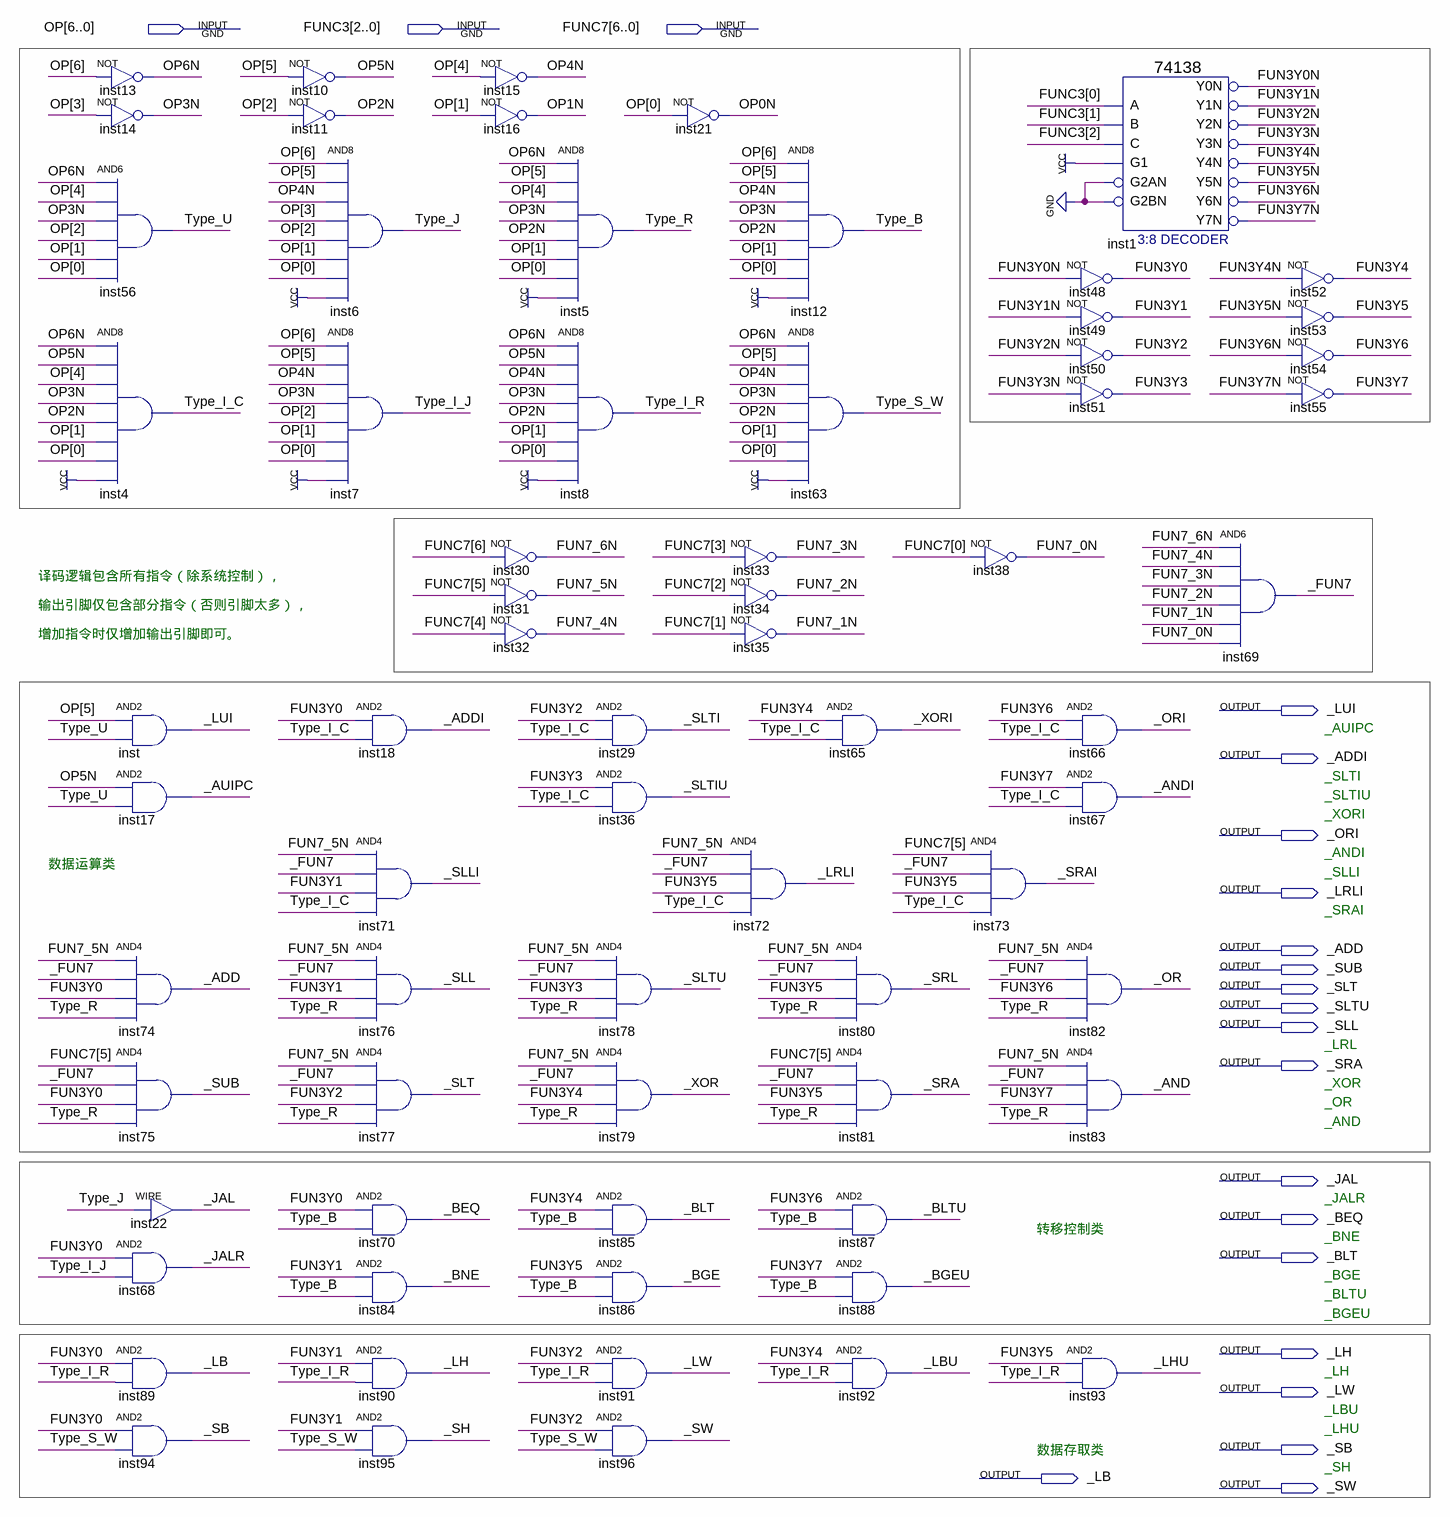
[diagram p0: schematic sheet]
// Quartus schematic ID.bdf as structural Verilog: 69 symbols, 21 pins
module ID (
  input  [6:0] OP,
  input  [2:0] FUNC3,
  input  [6:0] FUNC7,
  output _LUI,
  output _ADDI,
  output _ORI,
  output _LRLI,
  output _ADD,
  output _SUB,
  output _SLT,
  output _SLTU,
  output _SLL,
  output _SRA,
  output _JAL,
  output _BEQ,
  output _BLT,
  output _LH,
  output _LW,
  output _SB,
  output _LB,
  output _SW
);

  wire _AND, _ANDI, _AUIPC, _BGE, _BGEU, _BLTU, _BNE, _FUN7, _JALR, _LBU, _LHU, _OR, _SH, _SLLI, _SLTI,
       _SLTIU, _SRAI, _SRL, _XOR, _XORI, FUN3Y0, FUN3Y0N, FUN3Y1, FUN3Y1N, FUN3Y2, FUN3Y2N, FUN3Y3, FUN3Y3N,
       FUN3Y4, FUN3Y4N, FUN3Y5, FUN3Y5N, FUN3Y6, FUN3Y6N, FUN3Y7, FUN3Y7N, FUN7_0N, FUN7_1N, FUN7_2N,
       FUN7_3N, FUN7_4N, FUN7_5N, FUN7_6N, OP0N, OP1N, OP2N, OP3N, OP4N, OP5N, OP6N, Type_B, Type_I_C,
       Type_I_J, Type_I_R, Type_J, Type_R, Type_S_W, Type_U;

  not inst13 (OP6N, OP[6]);
  not inst14 (OP3N, OP[3]);
  and inst56 (Type_U, OP6N, OP[4], OP3N, OP[2], OP[1], OP[0]);
  and inst4 (Type_I_C, OP6N, OP5N, OP[4], OP3N, OP2N, OP[1], OP[0], 1'b1);
  and inst (_LUI, OP[5], Type_U);
  and inst17 (_AUIPC, OP5N, Type_U);
  and inst74 (_ADD, FUN7_5N, _FUN7, FUN3Y0, Type_R);
  and inst75 (_SUB, FUNC7[5], _FUN7, FUN3Y0, Type_R);
  assign _JAL = Type_J;  // WIRE inst22
  and inst68 (_JALR, FUN3Y0, Type_I_J);
  and inst89 (_LB, FUN3Y0, Type_I_R);
  and inst94 (_SB, FUN3Y0, Type_S_W);
  not inst10 (OP5N, OP[5]);
  not inst11 (OP2N, OP[2]);
  and inst6 (Type_J, OP[6], OP[5], OP4N, OP[3], OP[2], OP[1], OP[0], 1'b1);
  and inst7 (Type_I_J, OP[6], OP[5], OP4N, OP3N, OP[2], OP[1], OP[0], 1'b1);
  and inst18 (_ADDI, FUN3Y0, Type_I_C);
  and inst71 (_SLLI, FUN7_5N, _FUN7, FUN3Y1, Type_I_C);
  and inst76 (_SLL, FUN7_5N, _FUN7, FUN3Y1, Type_R);
  and inst77 (_SLT, FUN7_5N, _FUN7, FUN3Y2, Type_R);
  and inst70 (_BEQ, FUN3Y0, Type_B);
  and inst84 (_BNE, FUN3Y1, Type_B);
  and inst90 (_LH, FUN3Y1, Type_I_R);
  and inst95 (_SH, FUN3Y1, Type_S_W);
  not inst15 (OP4N, OP[4]);
  not inst16 (OP1N, OP[1]);
  not inst30 (FUN7_6N, FUNC7[6]);
  not inst31 (FUN7_5N, FUNC7[5]);
  not inst32 (FUN7_4N, FUNC7[4]);
  and inst5 (Type_R, OP6N, OP[5], OP[4], OP3N, OP2N, OP[1], OP[0], 1'b1);
  and inst8 (Type_I_R, OP6N, OP5N, OP4N, OP3N, OP2N, OP[1], OP[0], 1'b1);
  and inst29 (_SLTI, FUN3Y2, Type_I_C);
  and inst36 (_SLTIU, FUN3Y3, Type_I_C);
  and inst78 (_SLTU, FUN7_5N, _FUN7, FUN3Y3, Type_R);
  and inst79 (_XOR, FUN7_5N, _FUN7, FUN3Y4, Type_R);
  and inst85 (_BLT, FUN3Y4, Type_B);
  and inst86 (_BGE, FUN3Y5, Type_B);
  and inst91 (_LW, FUN3Y2, Type_I_R);
  and inst96 (_SW, FUN3Y2, Type_S_W);
  not inst21 (OP0N, OP[0]);
  and inst12 (Type_B, OP[6], OP[5], OP4N, OP3N, OP2N, OP[1], OP[0], 1'b1);
  and inst63 (Type_S_W, OP6N, OP[5], OP4N, OP3N, OP2N, OP[1], OP[0], 1'b1);
  not inst33 (FUN7_3N, FUNC7[3]);
  not inst34 (FUN7_2N, FUNC7[2]);
  not inst35 (FUN7_1N, FUNC7[1]);
  and inst72 (_LRLI, FUN7_5N, _FUN7, FUN3Y5, Type_I_C);
  and inst65 (_XORI, FUN3Y4, Type_I_C);
  and inst80 (_SRL, FUN7_5N, _FUN7, FUN3Y5, Type_R);
  and inst81 (_SRA, FUNC7[5], _FUN7, FUN3Y5, Type_R);
  and inst87 (_BLTU, FUN3Y6, Type_B);
  and inst88 (_BGEU, FUN3Y7, Type_B);
  and inst92 (_LBU, FUN3Y4, Type_I_R);
  not inst38 (FUN7_0N, FUNC7[0]);
  and inst73 (_SRAI, FUNC7[5], _FUN7, FUN3Y5, Type_I_C);
  \74138  inst1 (
    .A(FUNC3[0]), .B(FUNC3[1]), .G1(1'b1), .C(FUNC3[2]), .G2AN(1'b0), .G2BN(1'b0), .Y0N(FUN3Y0N),
    .Y1N(FUN3Y1N), .Y2N(FUN3Y2N), .Y3N(FUN3Y3N), .Y4N(FUN3Y4N), .Y5N(FUN3Y5N), .Y6N(FUN3Y6N), .Y7N(FUN3Y7N));
  not inst48 (FUN3Y0, FUN3Y0N);
  not inst49 (FUN3Y1, FUN3Y1N);
  not inst50 (FUN3Y2, FUN3Y2N);
  not inst51 (FUN3Y3, FUN3Y3N);
  and inst66 (_ORI, FUN3Y6, Type_I_C);
  and inst67 (_ANDI, FUN3Y7, Type_I_C);
  and inst82 (_OR, FUN7_5N, _FUN7, FUN3Y6, Type_R);
  and inst83 (_AND, FUN7_5N, _FUN7, FUN3Y7, Type_R);
  and inst93 (_LHU, FUN3Y5, Type_I_R);
  and inst69 (_FUN7, FUN7_6N, FUN7_4N, FUN7_3N, FUN7_2N, FUN7_1N, FUN7_0N);
  not inst52 (FUN3Y4, FUN3Y4N);
  not inst53 (FUN3Y5, FUN3Y5N);
  not inst54 (FUN3Y6, FUN3Y6N);
  not inst55 (FUN3Y7, FUN3Y7N);

  // Notes on the sheet:
  //   译码逻辑包含所有指令（除系统控制），
  //   输出引脚仅包含部分指令（否则引脚太多），
  //   增加指令时仅增加输出引脚即可。
  //   _AUIPC
  //   _SLTI
  //   _SLTIU
  //   _XORI
  //   _ANDI
  //   数据运算类
  //   _SLLI
  //   _SRAI
  //   _LRL
  //   _XOR
  //   _OR
  //   _AND
  //   _JALR
  //   转移控制类
  //   _BNE
  //   _BGE
  //   _BLTU
  //   _BGEU
  //   _LH
  //   _LBU
  //   _LHU
  //   数据存取类
  //   _SH
endmodule
